# Altium schematic sheet Alimentacion.SchDoc
size A4
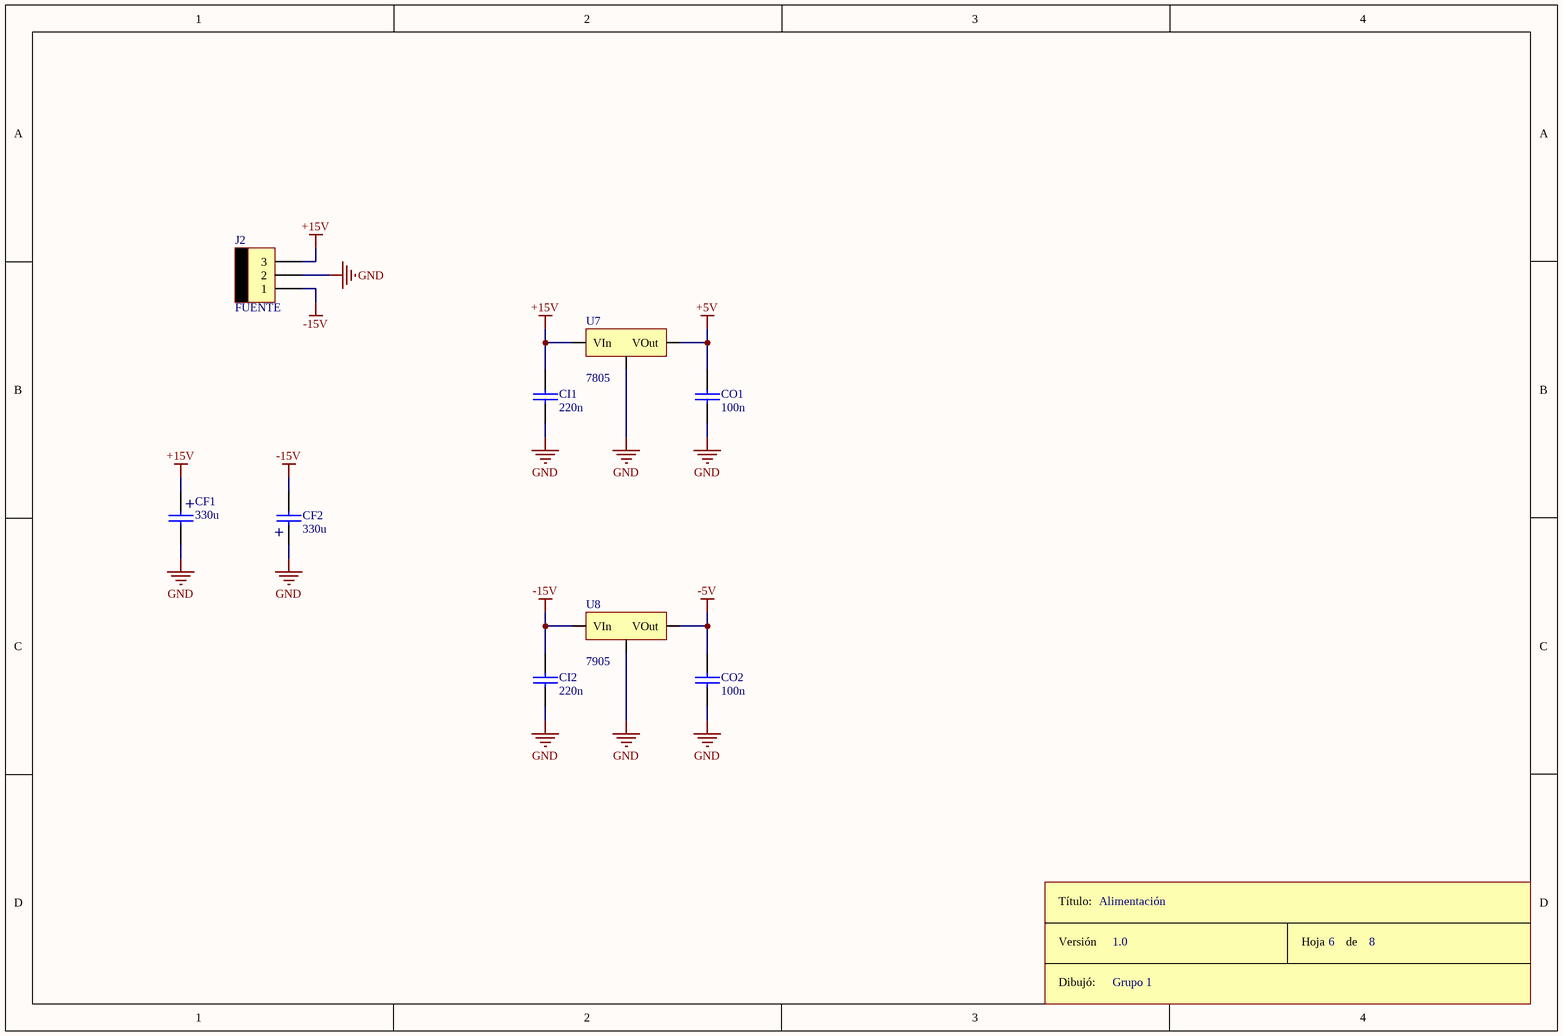
[diagram p0: Alimentacion.SchDoc]

## Parts
CF1  330u  [CAP200RP]
CF2  330u  [CAP200RP]
CI1  220n  [CAP100]
CI2  220n  [CAP100]
CO1  100n  [CAP100]
CO2  100n  [CAP100]
J2  FUENTE  [MOLEX3]
ROT5  Rótulo  (value not drawn)
U7  7805  [TO-220 V]
U8  7905  [TO-220 V]

## Nets
+5V: CO1.1 U7.3(VOut)
+15V: CF1.1 CI1.1 J2.3 U7.1(VIn)
-5V: CO2.1 U8.3(VOut)
-15V: CF2.2 CI2.1 J2.1 U8.2(VIn)
GND: CF1.2 CF2.1 CI1.2 CI2.2 CO1.2 CO2.2 J2.2 U7.2(GND) U8.1(GND)

## Notes on the sheet
- Alimentación
- 1.0
- Grupo 1
- 6
- 8
- (in symbol CAPPOL) +
- (in symbol Rótulo) Título:; Versión; Hoja       de; Dibujó:

## Library data of the parts
CF1 CF2 = CAPPOL
CI1 CI2 CO1 CO2 = CAP
J2 = MOLEX3
U7 = 78XX: REGULDOR POSITIVO
U8 = 79XX: REGULADOR NEGATIVO